# Altium schematic sheet core-board.SchDoc
size A3
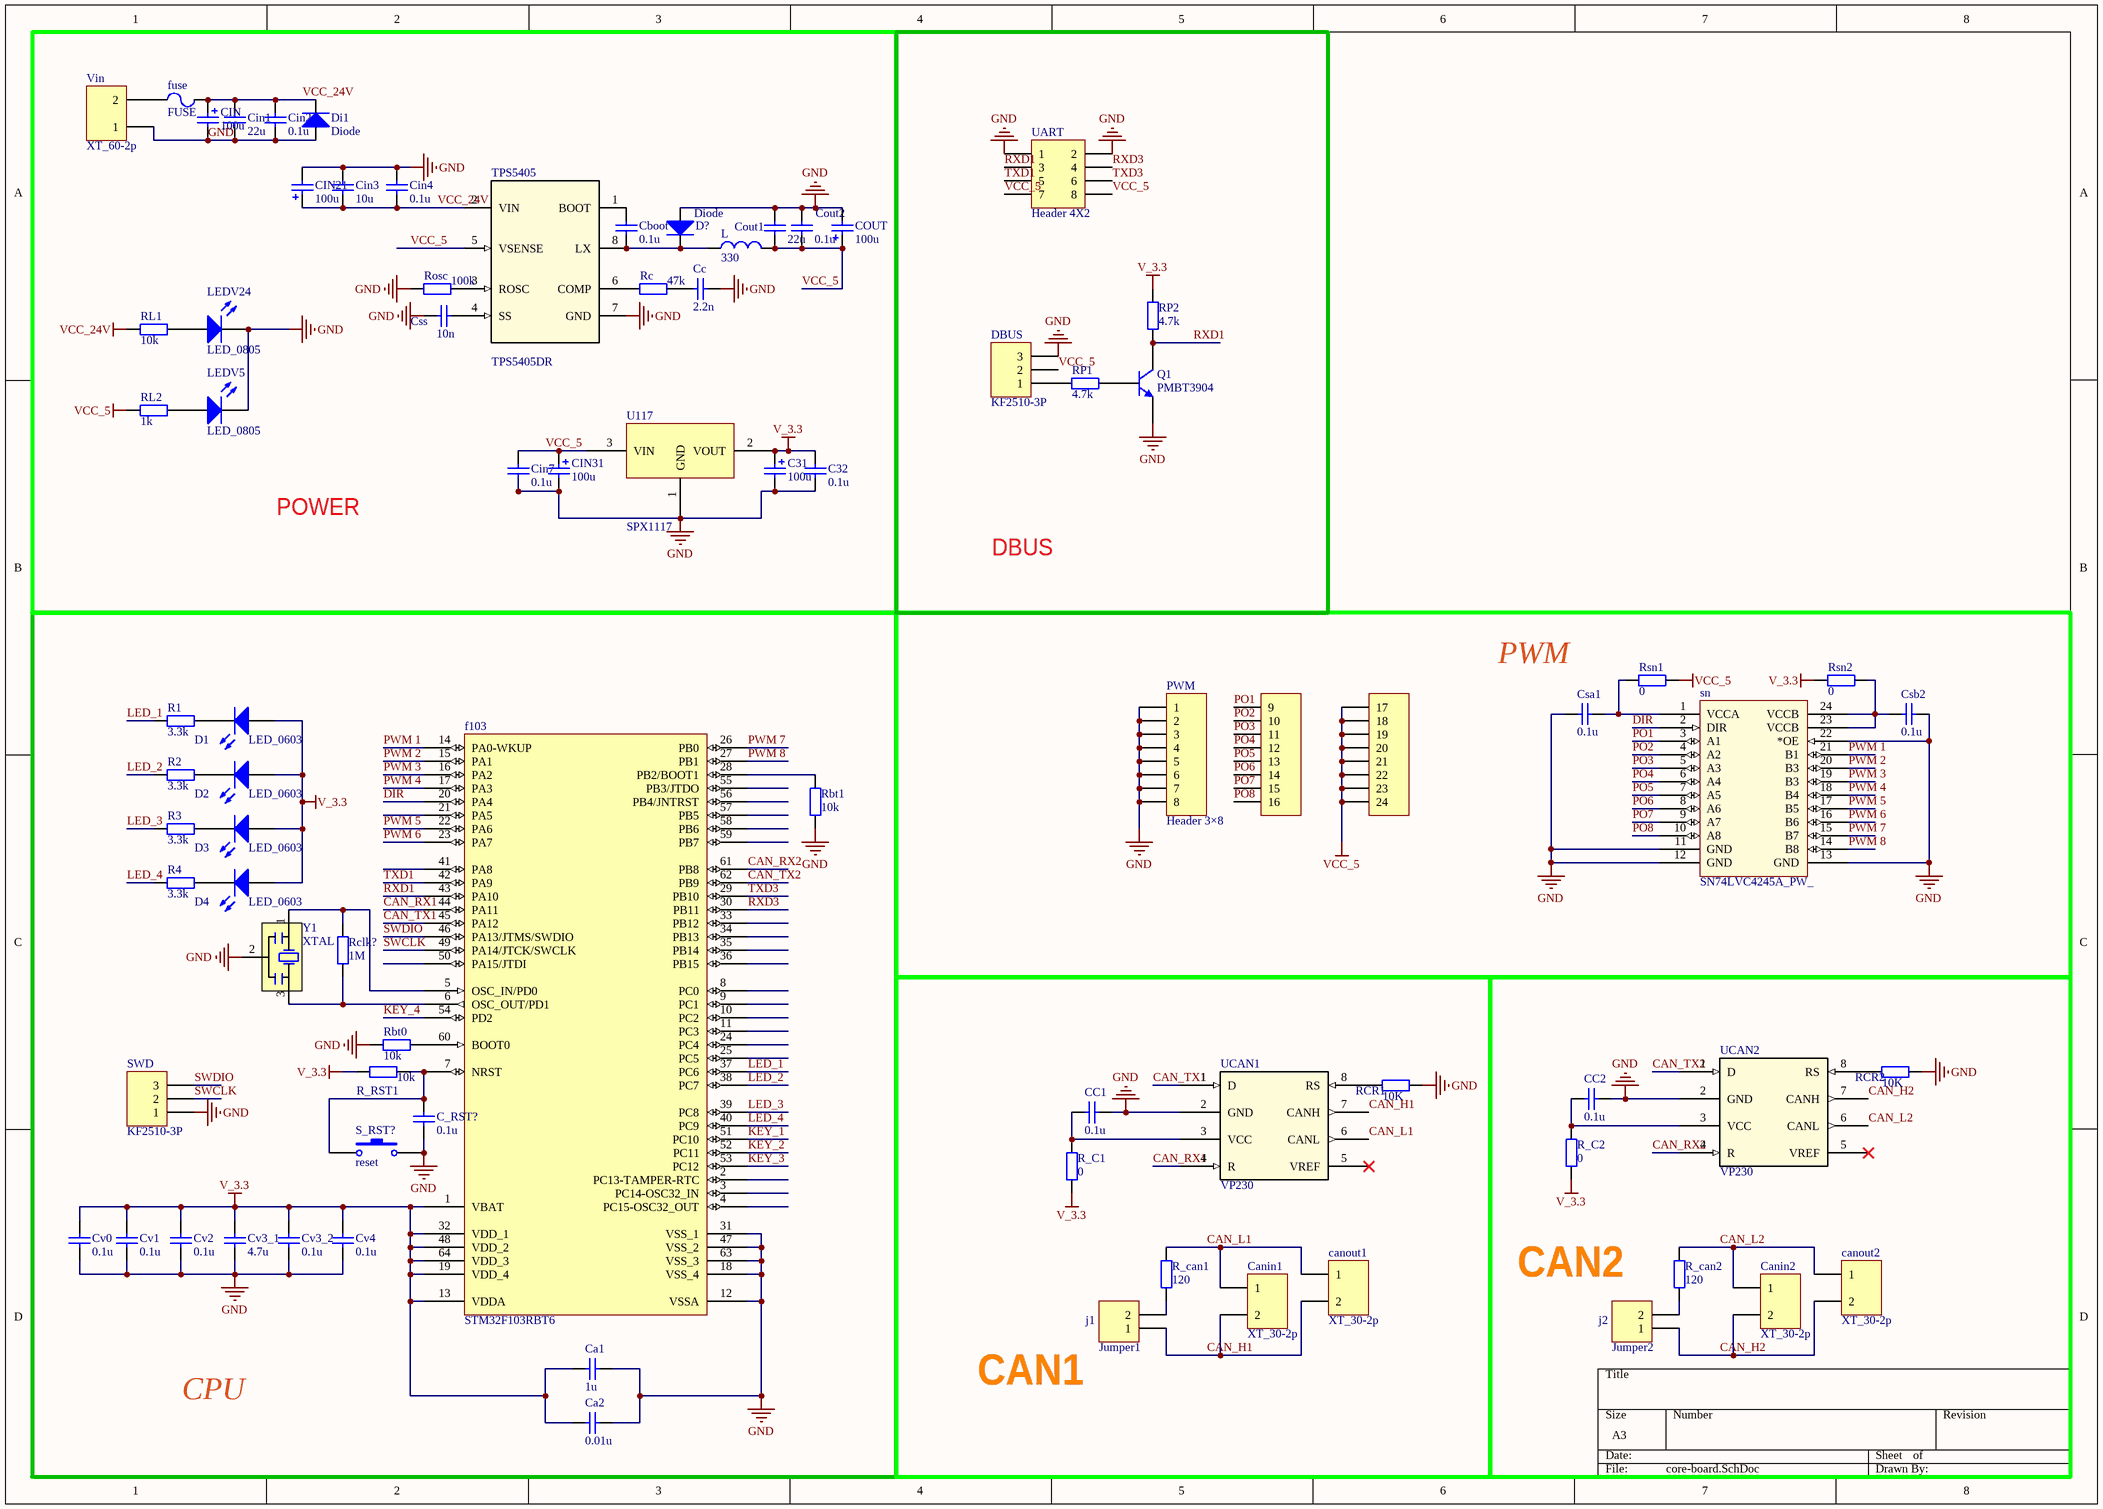
[diagram p0: core-board.SchDoc]

## Parts
C31  100u  [CAP _TAN_E_7343]
C32  0.1u  [C0805]
C_RST?  0.1u  [C0603]
Ca1  1u  [C0603]
Ca2  0.01u  [C0603]
Canin1  XT_30-2p  [XT_30-2P]
Canin2  XT_30-2p  [XT_30-2P]
canout1  XT_30-2p  [XT_30-2P]
canout2  XT_30-2p  [XT_30-2P]
Cboot  0.1u  [C0805]
Cc  2.2n  [C0805]
CC1  0.1u  [C0805]
CC2  0.1u  [C0805]
CIN  100u  [CAP _TAN_E_7343]
Cin1  22u  [C0805]
Cin2  0.1u  [C0805]
Cin3  10u  [C0805]
Cin4  0.1u  [C0805]
Cin7  0.1u  [C0805]
CIN21  100u  [CAP _TAN_E_7343]
CIN31  100u  [CAP _TAN_E_7343]
COUT  100u  [CAP _TAN_E_7343]
Cout1  22u  [C0805]
Cout2  0.1u  [C0805]
Csa1  0.1u  [C0603]
Csb2  0.1u  [C0603]
Css  10n  [C0805]
Cv0  0.1u  [C0603]
Cv1  0.1u  [C0603]
Cv2  0.1u  [C0603]
Cv3_1  4.7u  [C0603]
Cv3_2  0.1u  [C0603]
Cv4  0.1u  [C0603]
D1  LED_0603  [LED_0603]
D2  LED_0603  [LED_0603]
D3  LED_0603  [LED_0603]
D4  LED_0603  [LED_0603]
D?  Diode  [1206]
DBUS  KF2510-3P  [KF2510-3P]
Di1  Diode  [1206]
f103  STM32F103RBT6  [LQFP64_M]
fuse  FUSE  [2512]
j1  Jumper1  [jumper]
j2  Jumper2  [jumper]
L  330  [inductor330]
LEDV5  LED_0805  [LED_0805]
LEDV24  LED_0805  [LED_0805]
PWM  Header 3×8  [HDR3X8]
Q1  PMBT3904  [SOT23]
R1  3.3k  [R0603]
R2  3.3k  [R0603]
R3  3.3k  [R0603]
R4  3.3k  [R0603]
R_C1  0  [R0805]
R_C2  0  [R0805]
R_can1  120  [R0805]
R_can2  120  [R0805]
R_RST1  10k  [R0603]
Rbt0  10k  [R0603]
Rbt1  10k  [R0603]
Rc  47k  [R0805]
Rclk?  1M  [R0603]
RCR1  10K  [R0805]
RCR2  10K  [R0805]
RL1  10k  [R0805]
RL2  1k  [R0805]
Rosc  100k  [R0805]
RP1  4.7k  [R0603]
RP2  4.7k  [R0603]
Rsn1  0  [R0603]
Rsn2  0  [R0603]
S_RST?  reset  [SW]
sn  SN74LVC4245A_PW_  [SN74LVC4245A_PW_]
SWD  KF2510-3P  [KF2510-3P]
TPS5405  TPS5405DR  [D0008A_M]
U117  SPX1117  [SPX1117]
UART  Header 4X2  [HDR2X4]
UCAN1  VP230  [VP230]
UCAN2  VP230  [VP230]
Vin  XT_60-2p  [XT_60-2P]
Y1  XTAL  [SMD-3P]

## Blocks framed on the sheet
CAN1: Canin1 canout1 CC1 j1 R_C1 R_can1 RCR1 UCAN1
CAN2: Canin2 canout2 CC2 j2 R_C2 R_can2 RCR2 UCAN2

## Nets
GND: C31.2 C32.2 C_RST?.1 Ca1.1 Ca2.1 Cc.1 CC1.1 CC2.1 CIN.2 Cin1.1 Cin2.1 Cin3.1 Cin4.1 Cin7.2 CIN21.2 CIN31.2 COUT.2 Cout1.2 Cout2.2 Csa1.1 Csb2.2 Css.1 Cv0.1 Cv1.1 Cv2.1 Cv3_1.1 Cv3_2.1 Cv4.1 D?.1(A) DBUS.3 Di1.1(A) f103.12(VSSA) f103.18(VSS_4) f103.31(VSS_1) f103.47(VSS_2) f103.63(VSS_3) LEDV5.2(K) LEDV24.2(K) PWM.1 PWM.2 PWM.3 PWM.4 PWM.5 PWM.6 PWM.7 PWM.8 Q1.2(E) Rbt0.2 Rbt1.1 RCR1.1 RCR2.1 Rosc.1 S_RST?.2 sn.11(GND) sn.12(GND) sn.13(GND) sn.22(*OE) SWD.1 TPS5405.7(GND) U117.1(GND) UART.1 UART.2 UCAN1.2(GND) UCAN2.2(GND) Vin.1 Y1.2(OSC2)
V_3.3: C31.1 C32.1 Ca1.2 Ca2.2 Cv0.2 Cv1.2 Cv2.2 Cv3_1.2 Cv3_2.2 Cv4.2 D1.1(A) D2.1(A) D3.1(A) D4.1(A) f103.1(VBAT) f103.13(VDDA) f103.19(VDD_4) f103.32(VDD_1) f103.48(VDD_2) f103.64(VDD_3) R_C1.1 R_C2.1 R_RST1.2 RP2.2 Rsn2.1 U117.2(VOUT)
VCC_5: Cin7.1 CIN31.1 COUT.1 Cout1.1 Cout2.1 DBUS.2 L.2 PWM.17 PWM.18 PWM.19 PWM.20 PWM.21 PWM.22 PWM.23 PWM.24 RL2.1 Rsn1.1 TPS5405.5(VSENSE) U117.3(VIN) UART.7 UART.8
VCC_24V: CIN.1 Cin1.2 Cin2.2 Cin3.2 Cin4.2 CIN21.1 Di1.2(K) fuse.2 RL1.1 TPS5405.2(VIN)
CAN_H1: Canin1.2 canout1.2 j1.1 UCAN1.7(CANH)
CAN_H2: Canin2.2 canout2.2 j2.1 UCAN2.7(CANH)
CAN_L1: Canin1.1 canout1.1 R_can1.2 UCAN1.6(CANL)
CAN_L2: Canin2.1 canout2.1 R_can2.2 UCAN2.6(CANL)
CAN_RX1: f103.44(PA11) UCAN1.4(R)
CAN_RX2: f103.61(PB8) UCAN2.4(R)
CAN_TX1: f103.45(PA12) UCAN1.1(D)
CAN_TX2: f103.62(PB9) UCAN2.1(D)
DIR: f103.20(PA4) sn.2(DIR)
KEY_1: f103.51(PC10)
KEY_2: f103.52(PC11)
KEY_3: f103.53(PC12)
KEY_4: f103.54(PD2)
LED_1: f103.37(PC6) R1.1
LED_2: f103.38(PC7) R2.1
LED_3: f103.39(PC8) R3.1
LED_4: f103.40(PC9) R4.1
PO1: PWM.9 sn.3(A1)
PO2: PWM.10 sn.4(A2)
PO3: PWM.11 sn.5(A3)
PO4: PWM.12 sn.6(A4)
PO5: PWM.13 sn.7(A5)
PO6: PWM.14 sn.8(A6)
PO7: PWM.15 sn.9(A7)
PO8: PWM.16 sn.10(A8)
PWM 1: f103.14(PA0-WKUP) sn.21(B1)
PWM 2: f103.15(PA1) sn.20(B3)
PWM 3: f103.16(PA2) sn.19(B3)
PWM 4: f103.17(PA3) sn.18(B4)
PWM 5: f103.22(PA6) sn.17(B5)
PWM 6: f103.23(PA7) sn.16(B6)
PWM 7: f103.26(PB0) sn.15(B7)
PWM 8: f103.27(PB1) sn.14(B8)
RXD1: f103.43(PA10) Q1.3(C) RP2.1 UART.3
RXD3: f103.30(PB11) UART.4
SWCLK: f103.49(PA14/JTCK/SWCLK) SWD.2
SWDIO: f103.46(PA13/JTMS/SWDIO) SWD.3
TXD1: f103.42(PA9) UART.5
TXD3: f103.29(PB10) UART.6
NetC_RST?_2: C_RST?.2 f103.7(NRST) R_RST1.1 S_RST?.1
NetCboot_1: Cboot.1 D?.2(K) L.1 TPS5405.8(LX)
NetCboot_2: Cboot.2 TPS5405.1(BOOT)
NetCC1_2: CC1.2 R_C1.2 UCAN1.3(VCC)
NetCC2_2: CC2.2 R_C2.2 UCAN2.3(VCC)
NetCc_2: Cc.2 Rc.2
NetCsa1_2: Csa1.2 Rsn1.2 sn.1(VCCA)
NetCsb2_1: Csb2.1 Rsn2.2 sn.23(VCCB) sn.24(VCCB)
NetCss_2: Css.2 TPS5405.4(SS)
NetD1_2: D1.2(K) R1.2
NetD2_2: D2.2(K) R2.2
NetD3_2: D3.2(K) R3.2
NetD4_2: D4.2(K) R4.2
NetDBUS_1: DBUS.1 RP1.1
Netf103_5: f103.5(OSC_IN/PD0) Rclk?.2 Y1.1(OSC1)
Netf103_6: f103.6(OSC_OUT/PD1) Rclk?.1 Y1.3(OSC3)
Netf103_28: f103.28(PB2/BOOT1) Rbt1.2
Netf103_60: f103.60(BOOT0) Rbt0.1
Netfuse_1: fuse.1 Vin.2
Netj1_2: j1.2 R_can1.1
Netj2_2: j2.2 R_can2.1
NetLEDV5_1: LEDV5.1(A) RL2.2
NetLEDV24_1: LEDV24.1(A) RL1.2
NetQ1_1: Q1.1(B) RP1.2
NetRc_1: Rc.1 TPS5405.6(COMP)
NetRCR1_2: RCR1.2 UCAN1.8(RS)
NetRCR2_2: RCR2.2 UCAN2.8(RS)
NetRosc_2: Rosc.2 TPS5405.3(ROSC)

Not connected (* = marked no-connect by the designer): f103 2(PC13-TAMPER-RTC) 3(PC14-OSC32_IN) 4(PC15-OSC32_OUT) 8(PC0) 9(PC1) 10(PC2) 11(PC3) 21(PA5) 24(PC4) 25(PC5) 33(PB12) 34(PB13) 35(PB14) 36(PB15) 41(PA8) 50(PA15/JTDI) 55(PB3/JTDO) 56(PB4/JNTRST) 57(PB5) 58(PB6) 59(PB7); UCAN1 5(VREF)*; UCAN2 5(VREF)*

## Notes on the sheet
- POWER
- DBUS
- (near Csa1) PWM
- CPU

## Library data of the parts
C31 CIN CIN21 CIN31 COUT = CAP _TAN_E_7343
C32 Cboot Cc CC1 CC2 Cin1-Cin4 Cin7 Cout1 Cout2 Css = CAP_0805
C_RST? Ca1 Ca2 Csa1 Csb2 Cv0-Cv2 Cv3_1 Cv3_2 Cv4 = CAP_0603
j1 j2 = Jumper
L = LQH3NPN100
Q1 = PMBT3904: NPN Switching Transistor; Published: 17-Sep-2003; DatasheetDocument: 27-Apr-1999; PackageDocument: May-1999; PackageReference: SOT23; Publisher: Altium Limited
R1-R4 R_RST1 Rbt0 Rbt1 Rclk? RP1 RP2 Rsn1 Rsn2 = RES_0603
R_C1 R_C2 R_can1 R_can2 Rc RCR1 RCR2 RL1 RL2 Rosc = RES_0805
S_RST? = SW-PB: Switch; Published: 24-Mar-1999; LatestRevisionDate: 17-Jul-2002; LatestRevisionNote: Re-released for DXP Platform.; Publisher: Altium Limited
sn = SN74LVC4245A_PW_: Manufacturer: Texas Instruments; Manufacturer_Part_Number: sn74lvc4245a_pw_24; INDUSTRY_STD_PKG_TYPE: TSSOP; FAMILY_NAME: DIRECTION CONTROL DUAL SUPPLY TRANSLATOR; PIN_COUNT: 24; PACKAGE_DESIGNATOR: PW; Datasheet URL: http://www.ti.com/lit/gpn/SN74LVC4245A; GENERIC_PART_NUMBER: SN74LVC4245A; Vendor: Texas Instruments; RefDes: RefDes; Type: DEV; Value: Value
TPS5405 = TPS5403DR: Imported; Manufacturer: Texas Instruments; PartNumber: TPS5403DR; RefDes: RefDes; Type: DEV; Value: Value
UART = Header 4X2: Header, 4-Pin, Dual row; LatestRevisionDate: 17-Jul-2002; LatestRevisionNote: Re-released for DXP Platform.; Publisher: Altium Limited
Y1 = XTAL_C_MINI